# Altium schematic sheet 11_Audio Interface.schdoc
size 309 x 223 mm; Symbol: Sheet-Symbol_A4; Device: Sheet-Symbol_A4; Company: 嘉立创EDA; Version: V1.0; Page Size: A4; @Project Name: RK3568核心板; @Page Count: 13; @Update Date: 2024-10-10; @Create Date: 2024-10-10; @Schematic Name: Schematic1; @Page No: 10; @Page Name: Audio Interface; @Board Name: Board1; @Create Time: 11:29:57; @Update Time: 14:30:26
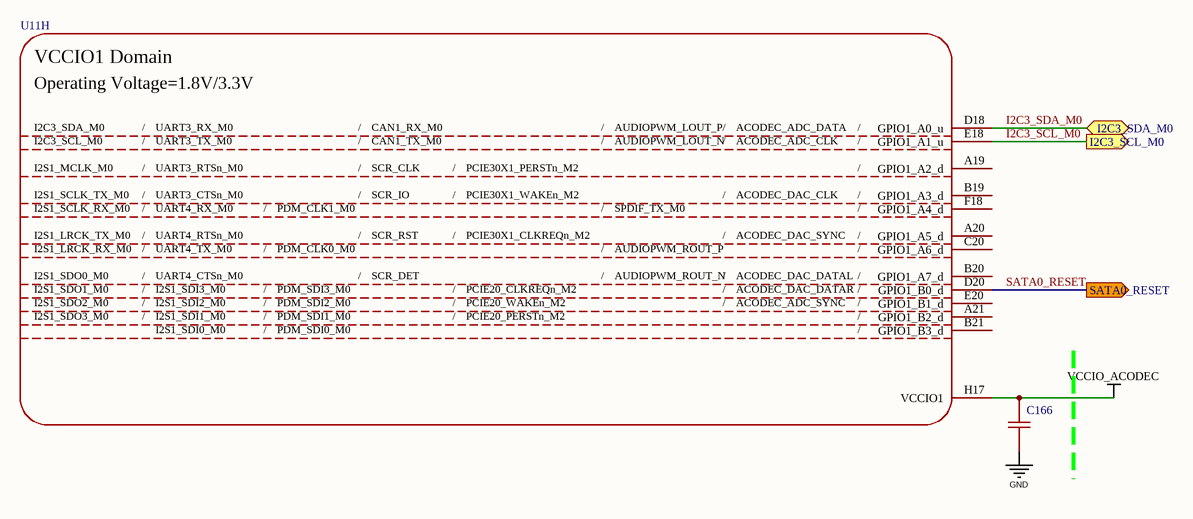
[diagram p0: 11_Audio Interface.schdoc]

## Parts
C166  100nF  [C0201]  (value not drawn)
U11  SOC_RK3568  [RK3568]  (value not drawn)  (part H of 23)

## Ports
I2C3_SCL_M0 (out), I2C3_SDA_M0 (bidir), SATA0_RESET (out)

## Nets
GND: C166.1
VCCIO_ACODEC: C166.2 U11.H17(VCCIO1)
I2C3_SCL_M0: U11.E18(GPIO1_A1_u) ; port I2C3_SCL_M0
I2C3_SDA_M0: U11.D18(GPIO1_A0_u) ; port I2C3_SDA_M0
SATA0_RESET: U11.D20(GPIO1_B0_d) ; port SATA0_RESET

Not connected (* = marked no-connect by the designer): U11 A19(GPIO1_A2_d) A20(GPIO1_A5_d) A21(GPIO1_B2_d) B19(GPIO1_A3_d) B20(GPIO1_A7_d) B21(GPIO1_B3_d) C20(GPIO1_A6_d) E20(GPIO1_B1_d) F18(GPIO1_A4_d)

## Notes on the sheet
- 1
- 2
- 3
- 4
- 5
- 6
- A
- B
- C
- 原理图
- Schematic1
- 创建日期
- 更新日期
- 2024-10-10
- 审阅
- 绘制
- 图页
- Audio Interface
- 物料编码
- RK3568核心板
- D
- 版本
- 尺寸
- 页
- 10
- 共
- 13
- V1.0
- A4
- 嘉立创EDA
- (in symbol SOC_RK3568, part H) VCCIO1 Domain; Operating Voltage=1.8V/3.3V; I2C3_SDA_M0; /; UART3_RX_M0; CAN1_RX_M0; AUDIOPWM_LOUT_P; ACODEC_ADC_DATA; I2C3_SCL_M0; UART3_TX_M0; CAN1_TX_M0; AUDIOPWM_LOUT_N; ACODEC_ADC_CLK; I2S1_MCLK_M0; UART3_RTSn_M0; SCR_CLK; PCIE30X1_PERSTn_M2; I2S1_SCLK_TX_M0; UART3_CTSn_M0; SCR_IO; PCIE30X1_WAKEn_M2; ACODEC_DAC_CLK; I2S1_SCLK_RX_M0; UART4_RX_M0; PDM_CLK1_M0; SPDIF_TX_M0; I2S1_LRCK_TX_M0; UART4_RTSn_M0; SCR_RST; PCIE30X1_CLKREQn_M2; ACODEC_DAC_SYNC; I2S1_LRCK_RX_M0; UART4_TX_M0; PDM_CLK0_M0; AUDIOPWM_ROUT_P; I2S1_SDO0_M0; UART4_CTSn_M0; SCR_DET; AUDIOPWM_ROUT_N; ACODEC_DAC_DATAL; I2S1_SDO1_M0; I2S1_SDI3_M0; PDM_SDI3_M0; PCIE20_CLKREQn_M2; ACODEC_DAC_DATAR; I2S1_SDO2_M0; I2S1_SDI2_M0; PDM_SDI2_M0; PCIE20_WAKEn_M2; ACODEC_ADC_SYNC; I2S1_SDO3_M0; I2S1_SDI1_M0; PDM_SDI1_M0; PCIE20_PERSTn_M2; I2S1_SDI0_M0; PDM_SDI0_M0

## Library data of the parts
C166 = CL03A104KO3NNNC: 容值:100nF;精度:±10%;额定电压:16V;材质(温度系数):X5R;; Manufacturer: SAMSUNG(三星); Add into BOM: yes; Tolerance: ±10%; Voltage Rated: 16V; Temperature Coefficient: X5R; Symbol: CL03A104KO3NNNC; Device: CL03A104KO3NNNC; LCSC Part Name: 100nF ±10% 16V; Supplier Part: C307380; Manufacturer Part: CL03A104KO3NNNC; Supplier Footprint: 0201; JLCPCB Part Class: 扩展库; Datasheet: https://atta.szlcsc.com/upload/public/pdf/source/20160218/1457707763339.pdf; Supplier: LCSC; Convert to PCB: yes; Value: 100nF
U11 = SOC_RK3568: Part Reference: U1000; Manufacturer: Rockchip (瑞芯微); PCB footprint: BGA636_19R00X19R00X1R20; SWAP_INFO: (S1+S2+S3+S4+S5+S6+S7+S8+S9+S10+S11+S12+S13+S14+S15+S16+S17+S18+S19+S20+S21+S22+S23); SPLIT_INST: TRUE; Value: RK3568; Priority: A; Add into BOM: yes; Relevance: []; Symbol: SOC_RK3568; Device: SOC_RK3568; RK PN: RK3568; Part Type: SOC; Manufacturer PN: RK3568; Created by: JJJ; Origin Footprint 2: BGA636_19R00X19R00X1R20; Convert to PCB: yes